# EAGLE design pure_energy (EAGLE 9.5.2)
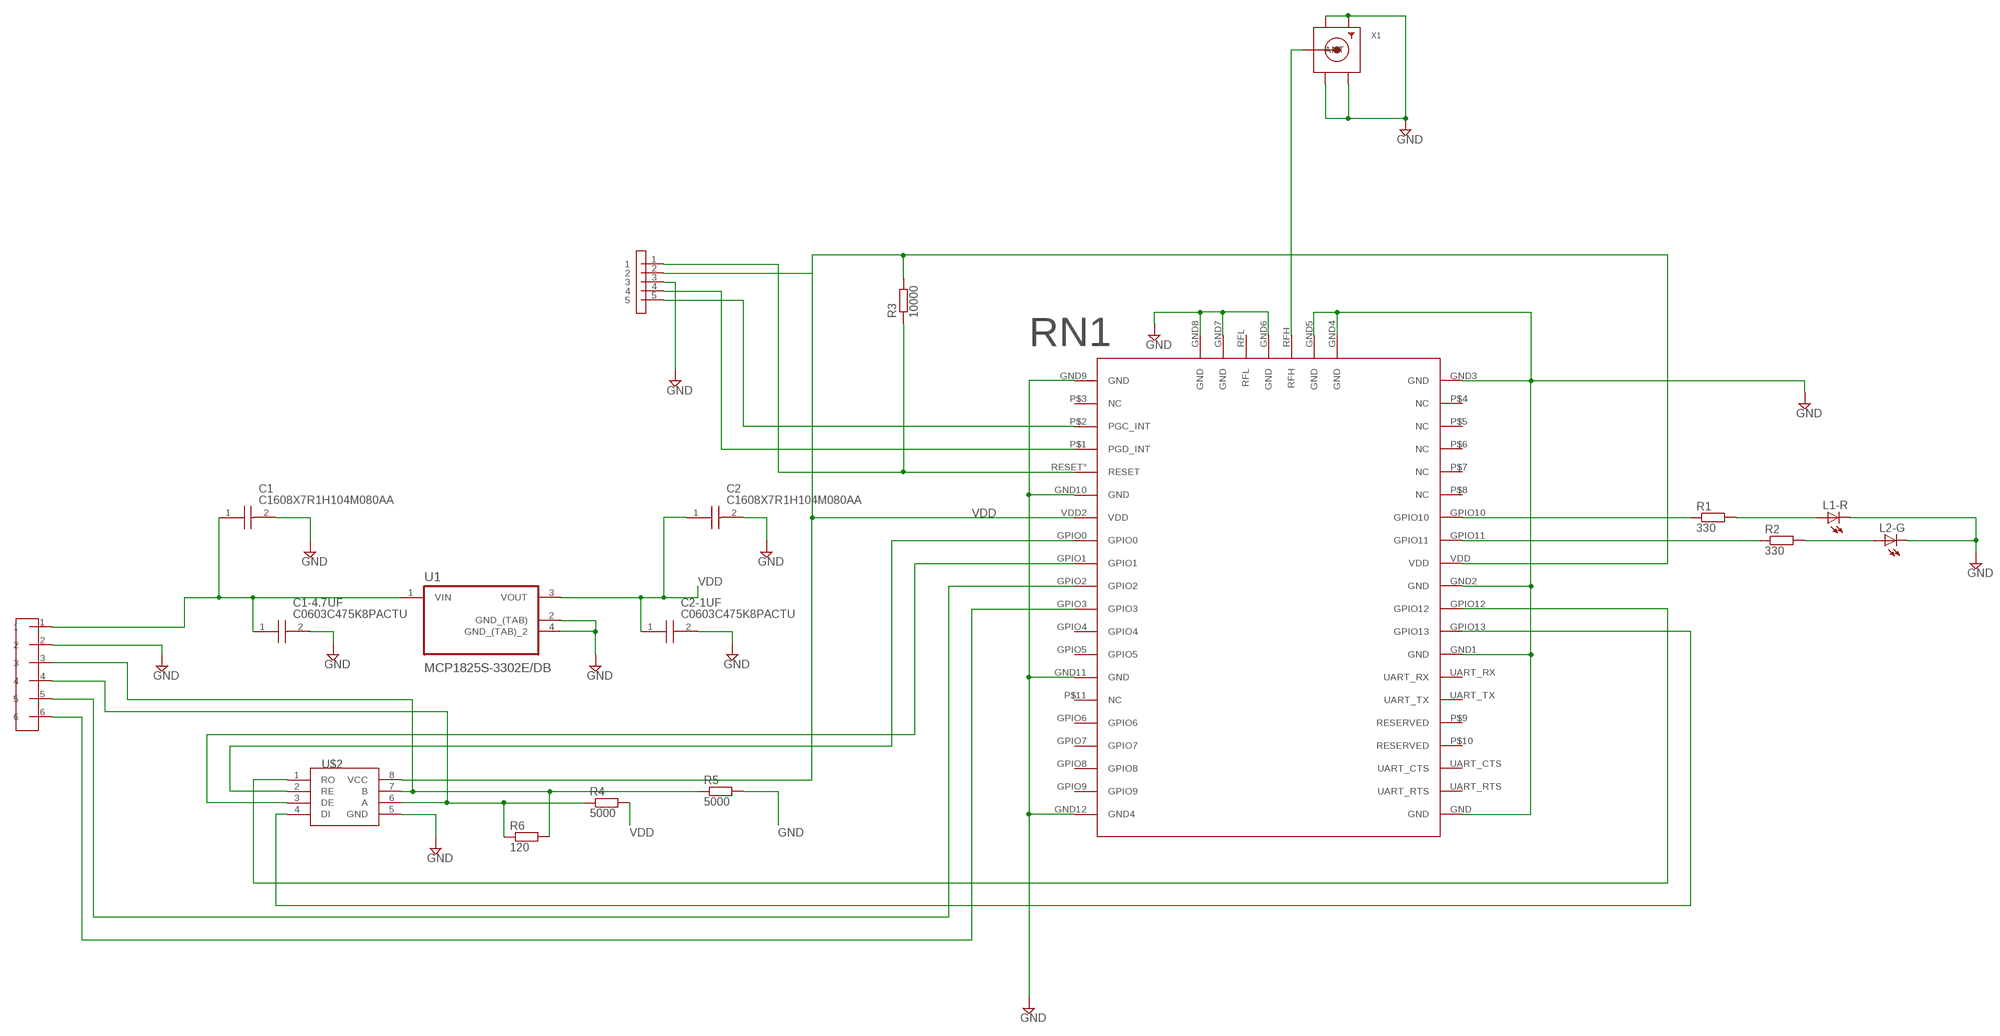
[diagram p0: schematic, sheet 1]

## Parts
C1  C1608X7R1H104M080AA  [CAPC1608X80N]
C1-4.7UF  C0603C475K8PACTU  [CAPC1608X85N]
C2  C1608X7R1H104M080AA  [CAPC1608X80N]
C2-1UF  C0603C475K8PACTU  [CAPC1608X85N]
L1-R  LEDCHIP-LED0603  [CHIP-LED0603]
L2-G  LEDCHIP-LED0603  [CHIP-LED0603]
R1  330  R-EU_R0603  [R0603]
R2  330  R-EU_R0603  [R0603]
R3  10000  R-EU_R0603  [R0603]
R4  5000  R-EU_R0805  [R0805]
R5  5000  R-EU_R0805  [R0805]
R6  120  R-EU_R0805  [R0805]
RN1  NEW_RN2483  [NEW_RN2483]
U1  MCP1825S-3302E/DB  [SOT230P700X180-4N]
U$1  CONNECTOR62  [CONNECTOR6]
U$2  AMD3485E  [AMD3485E]
U$3  ICSP52  [ICSP]
X1  SMACONNECTOR_EDGE  [SMA_EDGELAUNCH]

## Nets
GND: C1-4.7UF.2(C2) C1.2 C2-1UF.2(C2) C2.2 L1-R.C L2-G.C R5.2 RN1.GND RN1.GND1(GND) RN1.GND2(GND) RN1.GND3(GND) RN1.GND4(GND) RN1.GND5(GND) RN1.GND6(GND) RN1.GND7(GND) RN1.GND8(GND) RN1.GND9(GND) RN1.GND10(GND) RN1.GND11(GND) RN1.GND12(GND4) U1.2(GND_(TAB)) U1.4(GND_(TAB)_2) U$1.2 U$2.5(GND) U$3.3 X1.GND@1(GND4) X1.GND@2(GND3) X1.GND@3(GND2) X1.GND@4(GND1)
N$1: C1-4.7UF.1(C1) C1.1 U1.1(VIN) U$1.1
N$3: RN1.GPIO3 U$1.6
N$4: RN1.GPIO13 U$2.4(DI)
N$5: R5.1 R6.2 U$1.3 U$2.7(B)
N$6: R4.1 R6.1 U$1.4 U$2.6(A)
N$7: RN1.GPIO2 U$1.5
N$8: RN1.GPIO12 U$2.1(RO)
N$9: RN1.GPIO1 U$2.3(DE)
N$10: R1.1 RN1.GPIO10
N$11: R2.1 RN1.GPIO11
N$12: L1-R.A R1.2
N$13: L2-G.A R2.2
N$14: R3.1 RN1.RESET°(RESET) U$3.1
N$15: RN1.RFH X1.P(ANT)
N$16: RN1.GPIO0 U$2.2(RE)
N$17: RN1.P$1(PGD_INT) U$3.4
N$18: RN1.P$2(PGC_INT) U$3.5
VDD: C2-1UF.1(C1) C2.1 R3.2 R4.2 RN1.VDD RN1.VDD2(VDD) U1.3(VOUT) U$2.8(VCC) U$3.2
Unconnected: RN1.GPIO4 RN1.GPIO5 RN1.GPIO6 RN1.GPIO7 RN1.GPIO8 RN1.GPIO9 RN1.P$3(NC) RN1.P$4(NC) RN1.P$5(NC) RN1.P$6(NC) RN1.P$7(NC) RN1.P$8(NC) RN1.P$9(RESERVED) RN1.P$10(RESERVED) RN1.P$11(NC) RN1.RFL RN1.UART_CTS RN1.UART_RTS RN1.UART_RX RN1.UART_TX

## Library data of the parts
C1 C2 = C1608X7R1H104M080AA:C1608X7R1H104M080AA: TDK 0603 C 100nF Ceramic Multilayer Capacitor, 50 V dc, +125C, X7R Dielectric, +/-20% Source: Datasheet <https://product.tdk.com/info/en/catalog/datasheets/mlcc_commercial_midvoltage_en.pdf>; ARROW_PART_NUMBER: C1608X7R1H104M080AA; ARROW_PRICE-STOCK: https://www.arrow.com/en/products/c1608x7r1h104m080aa/tdk; DESCRIPTION: TDK 0603 C 100nF Ceramic Multilayer Capacitor, 50 V dc, +125C, X7R Dielectric, +/-20%; HEIGHT: 0.8mm; MANUFACTURER_NAME: TDK; MANUFACTURER_PART_NUMBER: C1608X7R1H104M080AA; MOUSER_PART_NUMBER: 810-C1608X7R1H104M; MOUSER_PRICE-STOCK: https://www.mouser.co.uk/ProductDetail/TDK/C1608X7R1H104M080AA?qs=dfay7wIA1uEL2BE%2FFUaTdg%3D%3D
C1-4.7UF C2-1UF = C0603C475K8PACTU:C0603C475K8PACTU: CAPACITOR, 0603 4.7uF +/-10% 10V Source: Datasheet <http://componentsearchengine.com/Datasheets/1/C0603C475K8PACTU.pdf>; ARROW_PART_NUMBER: C0603C475K8PACTU; ARROW_PRICE-STOCK: https://www.arrow.com/en/products/c0603c475k8pactu/kemet-corporation; DESCRIPTION: CAPACITOR, 0603 4.7uF +/-10% 10V; HEIGHT: mm; MANUFACTURER_NAME: Kemet; MANUFACTURER_PART_NUMBER: C0603C475K8PACTU; MOUSER_PART_NUMBER: 80-C0603C475K8P; MOUSER_PRICE-STOCK: https://www.mouser.co.uk/ProductDetail/KEMET/C0603C475K8PACTU?qs=K%2Fj%2Fqf%252B0fqK6lAUxhlPmKA%3D%3D
L1-R L2-G = adafruit:LED: LED OSRAM: - CHIPLED LG R971, LG N971, LY N971, LG Q971, LY Q971, LO R971, LY R971 LH N974, LH R974 LS Q976, LO Q976, LY Q976 LO Q996 - Hyper CHIPLED LW Q18S LB Q993, LB Q99A, LB R99A - SideLED LS A670, LO A670, LY A670, LG A670, LP A670 LB A673, LV A673, LT A673, LW A673 LH A674 LY A675 LS A676, LA A676, LO A676, LY A676, LW A676 LS A679, LY A679, LG A679 - Hyper Micro SIDELED® LS Y876, LA Y876, LO Y876, LY Y876 LT Y87S - SmartLED LW L88C, LW L88S LB L89C, LB L89S, LG L890 LS L89K, LO L89K, LY L89K LS L896, LA L896, LO L896, LY L896 - TOPLED LS T670, LO T670, LY T670, LG T670, LP T670 LSG T670, LSP T670, LSY T670, LOP T670, LYG T670 LG T671, LOG T671, LSG T671 LB T673, LV T673, LT T673, LW T673 LH T674 LS T676, LA T676, LO T676, LY T676, LB T676, LH T676, LSB T676, LW T676 LB T67C, LV T67C, LT T67C, LS T67K, LO T67K, LY T67K, LW E67C LS E67B, LA E67B, LO E67B, LY E67B, LB E67C, LV E67C, LT E67C LW T67C LS T679, LY T679, LG T679 LS T770, LO T770, LY T770, LG T770, LP T770 LB T773, LV T773, LT T773, LW T773 LH T774 LS E675, LA E675, LY E675, LS T675 LS T776, LA T776, LO T776, LY T776, LB T776 LHGB T686 LT T68C, LB T68C - Hyper Mini TOPLED® LB M676 - Mini TOPLED Santana® LG M470 LS M47K, LO M47K, LY M47K Source: http://www.osram.convergy.de/
R1-R6 = rcl:R-EU_: RESISTOR, European symbol; SPICEPREFIX: R
RN1 = tobias:NEW_RN2483
U1 = MCP1825S-3302E_DB:MCP1825S-3302E/DB; AVAILABILITY: Unavailable; DESCRIPTION: Linear Voltage Regulator IC 1 Output 500mA SOT-223-3; MF: Microchip; MP: MCP1825S-3302E/DB; PACKAGE: SOT-223 Microchip; PRICE: None
U$1 = conn4:CONNECTOR62
U$2 = AMD3485E:AMD3485E
U$3 = conn4:ICSP52
X1 = adafruit:SMACONNECTOR: SMA Connector 90° DIP SMA Connector, 50 Ohm (4UConnector: 07259)

## Board
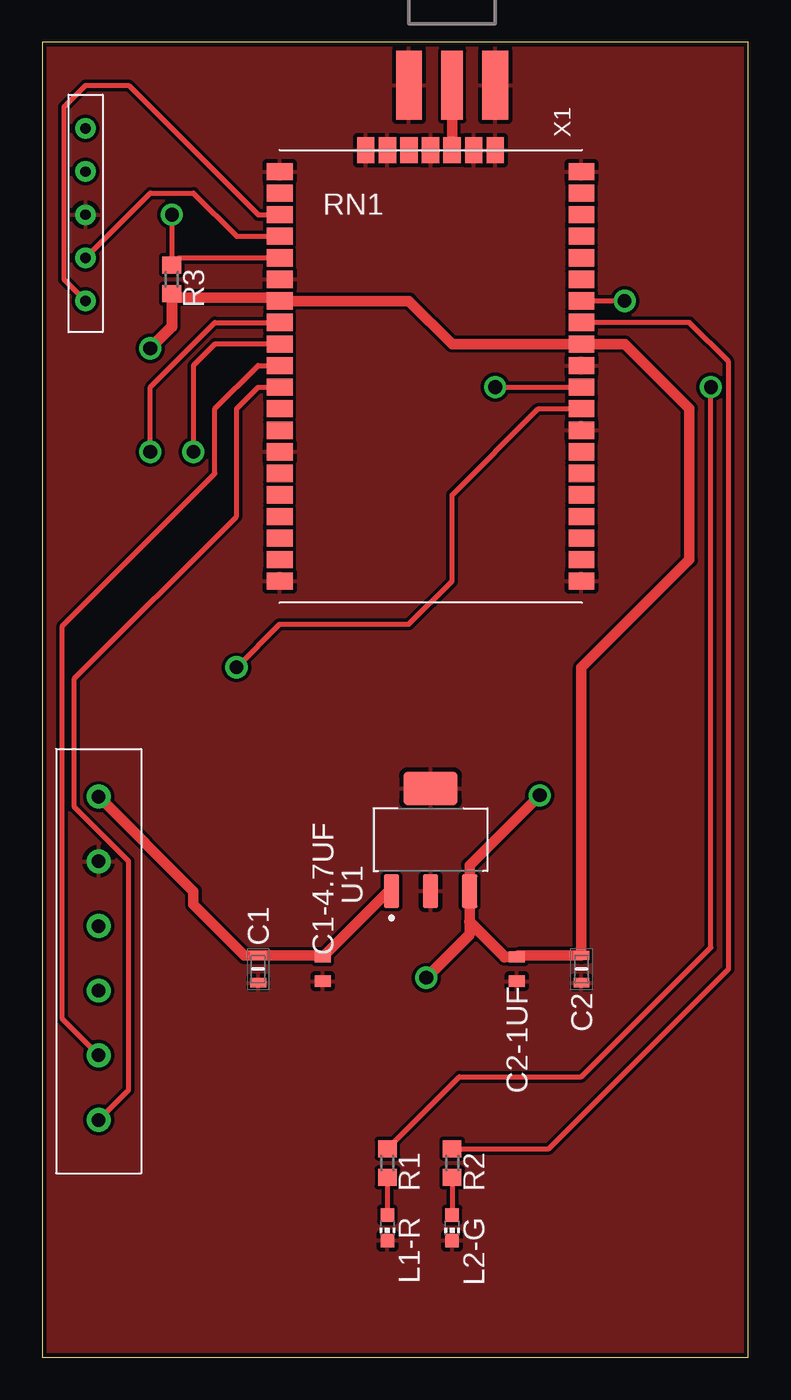
[diagram p1: board, top side]
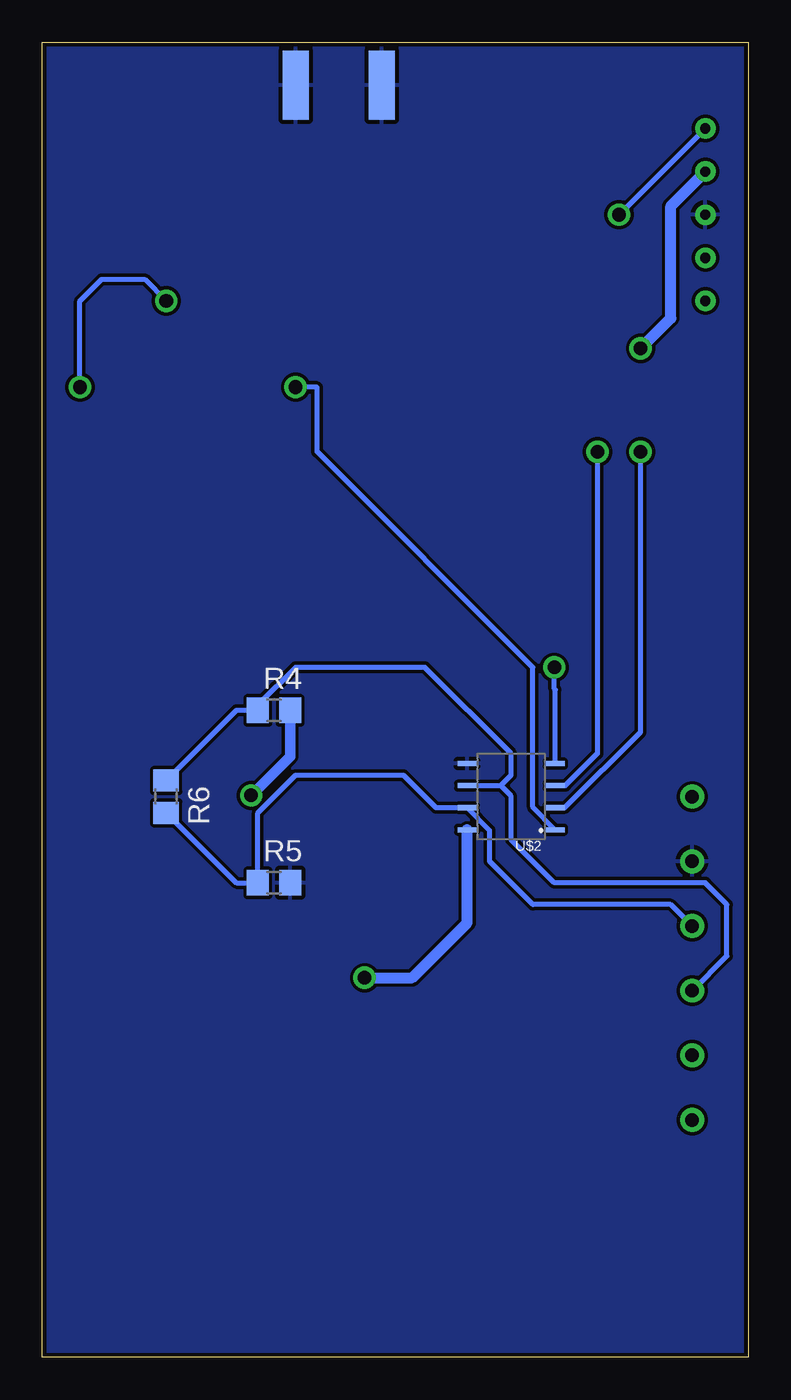
[diagram p2: board, bottom side, seen from below]

Size 41.58 x 77.46 mm. Coordinates in mm from the lower left corner, seen from the top.
Outline: 0,0 41.58,0 41.58,77.46 0,77.46 0,0
Copper layers (1*16): Top 0.035mm / dielectric 1.5mm / Bottom 0.035mm
Design rules "SparkFun": minimum track width 8mil, minimum drill 20mil, track to track 8mil, track to pad 8mil, pad to pad 8mil, via to via 8mil, smd to smd 8mil, copper to edge 10mil, drill to drill 8mil, minimum pad ring 12mil, minimum via ring 10mil, stop-mask expansion 4mil, vias tented up to drill 25mil, thermal gap 10mil

### Footprints (pad centres in the part's own frame; a part is rotated, then mirrored left to right if it is on the bottom)
CAPC1608X80N = smd 0.54 x 0.94: 1 -0.8,0; 2 0.8,0
CAPC1608X85N = smd 0.66 x 0.94: 1 -0.711,0; 2 0.711,0
CHIP-LED0603 = smd 0.8 x 0.8: A 0,-0.75; C 0,0.75
R0603 = smd 1 x 1.1: 1 -0.85,0; 2 0.85,0
R0805 = smd 1.3 x 1.5: 1 -0.95,0; 2 0.95,0
NEW_RN2483 = smd 1.524 x 1.016: GND 17.78,1.27; GND1 17.78,10.16; GND2 17.78,13.97; GND3 17.78,25.4; GND9 0,25.4; GND10 0,19.05; GND11 0,8.89; GND12 0,1.27; GPIO0 0,16.51; GPIO1 0,15.24; GPIO2 0,13.97; GPIO3 0,12.7; GPIO4 0,11.43; GPIO5 0,10.16; GPIO6 0,6.35; GPIO7 0,5.08; GPIO8 0,3.81; GPIO9 0,2.54; GPIO10 17.78,17.78; GPIO11 17.78,16.51; GPIO12 17.78,12.7; GPIO13 17.78,11.43; P$1 0,21.59; P$2 0,22.86; P$3 0,24.13; P$4 17.78,24.13; P$5 17.78,22.86; P$6 17.78,21.59; P$7 17.78,20.32; P$8 17.78,19.05; P$9 17.78,6.35; P$10 17.78,5.08; P$11 0,7.62; RESET° 0,20.32; UART_CTS 17.78,3.81; UART_RTS 17.78,2.54; UART_RX 17.78,8.89; UART_TX 17.78,7.62; VDD 17.78,15.24; VDD2 0,17.78 | smd 1.016 x 1.524: GND4 12.7,26.67; GND5 11.43,26.67; GND6 8.89,26.67; GND7 6.35,26.67; GND8 5.08,26.67; RFH 10.16,26.67; RFL 7.62,26.67
SOT230P700X180-4N = smd 1.97 x 0.89: 1 -3.025,2.3; 2 -3.025,0; 3 -3.025,-2.3 | smd 1.97 x 3.19: 4 3.025,0
CONNECTOR6 = drill 0.8: 1 -0.5,-3.81; 2 -0.5,-7.62; 3 -0.5,-11.43; 4 -0.5,-15.24; 5 -0.5,-19.05; 6 -0.5,-22.86
AMD3485E = smd 1.1 x 0.3: 1 -2.6,1.95; 2 -2.6,0.65; 3 -2.6,-0.65; 4 -2.6,-1.95; 5 2.6,-1.95; 6 2.6,-0.65; 7 2.6,0.65; 8 2.6,1.95
ICSP = drill 0.6: 1 -0.002,-0.002; 2 -0.002,-2.542; 3 -0.002,-5.082; 4 -0.002,-7.622; 5 -0.002,-10.162
SMA_EDGELAUNCH = smd 4.064 x 1.524: GND@1 2.032,-2.54; GND@2 2.032,2.54 | smd 4.064 x 1.524 bottom: GND@3 2.032,2.54; GND@4 2.032,-2.54 | smd 4.064 x 1.27: P 2.032,0

### Placement (x,y rotation side)
C1  12.7,22.86 270 top
C1-4.7UF  16.51,22.86 270 top
C2  31.75,22.86 270 top
C2-1UF  27.94,22.86 270 top
L1-R  20.32,7.62 180 top
L2-G  24.13,7.62 180 top
R1  20.32,11.43 270 top
R2  24.13,11.43 270 top
R3  7.62,63.5 270 top
R4  27.94,38.1 0 bottom
R5  27.94,27.94 0 bottom
R6  34.29,33.02 270 bottom
RN1  13.97,44.45 0 top
U1  22.86,30.48 90 top
U$1  3.81,36.83 0 top
U$2  13.97,33.02 180 bottom
U$3  2.54,72.39 0 top
X1  24.13,76.96 270 top

### Tracks (layer width: path | path; a pad name or v marks a point on that pad's centre or on a via)
GND
  pour Bottom: -2.54,80.01 41.91,80.01 45.72,76.2 45.72,-1.27 -1.27,-1.27 -5.08,2.54 -5.08,77.47
  pour Top: -3.81,81.28 45.72,81.28 48.26,78.74 48.26,64.77 48.26,0 43.18,-5.08 -3.81,-5.08 -8.89,0 -8.89,1.27 -8.89,76.2
N$1
  Top 0.61: U$1.1 8.89,27.44 8.89,26.67 9.53,26.04 11.9,23.66 C1.1 16.42,23.66 C1-4.7UF.1 20.39,27.46 U1.1
N$3
  Top 0.305: U$1.6 5.08,15.74 5.08,29.21 1.88,32.41 1.88,39.98 11.43,49.53 11.43,55.88 12.7,57.15 RN1.GPIO3
N$4  (via drill 0.8)
  Top 0.305: v11.43,40.64 13.97,43.18 21.59,43.18 24.13,45.72 24.13,50.8 29.21,55.88 RN1.GPIO13
  Bottom 0.305: U$2.4 11.37,39.31 11.43,39.37 v11.43,40.64
N$5
  Bottom 0.305: U$1.3 4.58,26.67 12.7,26.67 15.24,29.21 15.24,30.48 15.24,31.04 U$2.7 18.4,32.37 20.32,34.29 26.67,34.29 28.89,32.07 R5.1 30.16,27.94 R6.2
N$6
  Bottom 0.305: U$2.6 14.59,33.67 | 14.59,33.67 13.97,34.29 13.97,35.56 19.05,40.64 26.67,40.64 28.89,38.42 R4.1 30.16,38.1 R6.1 | U$1.4 1.27,23.63 1.27,26.67 2.54,27.94 11.43,27.94 13.97,30.48 13.97,33.05 14.59,33.67
N$7
  Top 0.305: U$1.5 1.17,19.92 1.17,43.08 10.16,52.07 10.16,55.88 12.7,58.42 RN1.GPIO2
N$8  (via drill 0.8)
  Top 0.305: v26.67,57.15 RN1.GPIO12
  Bottom 0.305: U$2.1 12.7,32.4 12.7,40.64 25.4,53.34 25.4,57.15 v26.67,57.15
N$9  (via drill 0.8)
  Top 0.305: RN1.GPIO1 10.16,59.69 8.89,58.42 v8.89,53.34
  Bottom 0.305: U$2.3 10.78,33.67 8.89,35.56 v8.89,53.34
N$10  (via drill 0.8)
  Top 0.305: R1.1 24.55,16.51 31.75,16.51 39.37,24.13 v39.37,57.15 | v34.29,62.23 RN1.GPIO10
  Bottom 0.305: v39.37,57.15 39.37,62.23 38.1,63.5 35.56,63.5 v34.29,62.23
N$11
  Top 0.305: R2.1 29.83,12.28 40.41,22.86 40.41,58.65 38.1,60.96 RN1.GPIO11
N$12
  Top 0.305: R1.2 L1-R.A
N$13
  Top 0.305: R2.2 L2-G.A
N$14  (via drill 0.8)
  Top 0.305: RN1.RESET° 8.04,64.77 R3.1 v7.62,67.31
  Bottom 0.305: U$3.1 6.35,68.58 v7.62,67.31
N$15
  Top 0.61: RN1.RFH X1.P
N$16  (via drill 0.8)
  Top 0.305: v6.35,53.34 6.35,57.15 10.16,60.96 RN1.GPIO0
  Bottom 0.305: U$2.2 10.81,32.37 6.35,36.83 v6.35,53.34
N$17
  Top 0.305: U$3.4 6.35,68.58 8.89,68.58 11.43,66.04 RN1.P$1
N$18
  Top 0.305: U$3.5 1.27,63.5 1.27,73.66 2.54,74.93 5.08,74.93 12.7,67.31 RN1.P$2
VDD  (via drill 0.8)
  Top 0.61: 27.23,23.57 C2-1UF.1 28.03,23.66 C2.1 31.75,40.64 38.1,46.99 38.1,55.88 34.29,59.69 RN1.VDD 24.13,59.69 21.59,62.23 RN1.VDD2 13.77,62.43 7.84,62.43 R3.2 7.62,62.23 | 25.16,25.64 U1.3 25.16,28.97 v29.29,33.1 | U$3.2
  Top 0.635: 27.23,23.57 25.16,25.64 25.16,24.91 v22.61,22.35 | 7.62,62.23 7.62,60.71 v6.35,59.44
  Bottom 0.61: v29.29,33.1 26.99,35.4 R4.2
  Bottom 0.635: v22.61,22.35 19.81,22.35 16.57,25.59 U$2.8 | v6.35,59.44 4.57,61.21 4.57,67.81 U$3.2